# EAGLE design SD2DIPSPI (EAGLE 7.2.0)
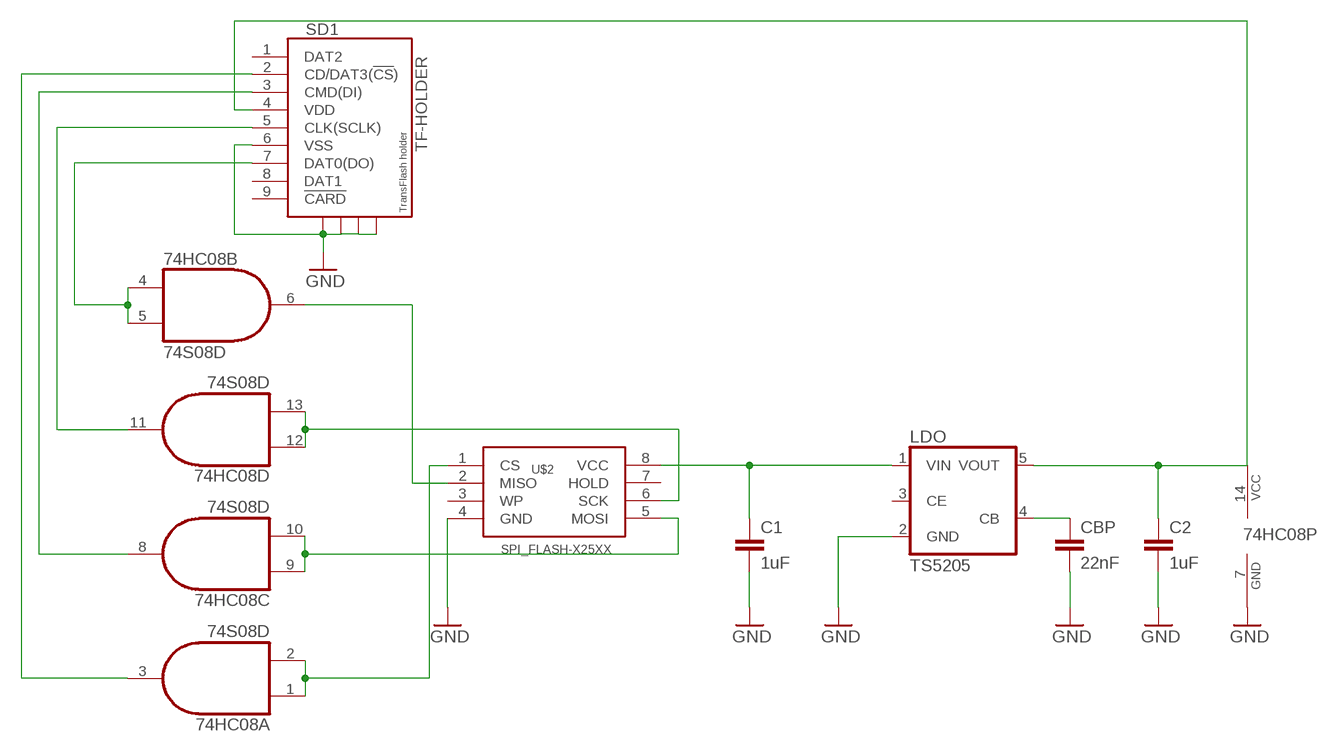
[diagram p0: schematic, sheet 1]

## Parts
74HC08  74S08D  [SO14]
C1  1uF  0.1UF-25V(+80/-20%)(0603)  [0603-CAP]
C2  1uF  0.1UF-25V(+80/-20%)(0603)  [0603-CAP]
CBP  22nF  0.1UF-16V(+-10%)(0402)  [0402-CAP]
LDO  TS5205  [SOT25]
SD1  TF-HOLDER  [TF-PULL]
U$2  SPI_FLASH-X25XX  [DIL08]

## Nets
3V3: 74HC08.14(P:VCC) C2.1 LDO.5(VOUT) SD1.4(VDD)
+5V: C1.1 LDO.1(VIN) U$2.8(VCC)
GND: 74HC08.7(P:GND) C1.2 C2.2 CBP.2 LDO.2(GND) SD1.6(VSS) SD1.S1 SD1.S2 SD1.S3 SD1.S4 U$2.4(GND)
N$2: CBP.1 LDO.4(CB)
N$12: 74HC08.9(C:I0) 74HC08.10(C:I1) U$2.5(MOSI)
N$21: 74HC08.12(D:I0) 74HC08.13(D:I1) U$2.6(SCK)
N$24: 74HC08.1(A:I0) 74HC08.2(A:I1) U$2.1(CS)
N$32: 74HC08.11(D:O) SD1.5(CLK(SCLK))
N$33: 74HC08.8(C:O) SD1.3(CMD(DI))
N$34: 74HC08.3(A:O) SD1.2(CD/DAT3(!CS!))
N$35: 74HC08.6(B:O) U$2.2(MISO)
N$38: 74HC08.4(B:I0) 74HC08.5(B:I1) SD1.7(DAT0(DO))
Unconnected: LDO.3(CE) SD1.1(DAT2) SD1.8(DAT1) SD1.9(!CARD) U$2.3(WP) U$2.7(HOLD)

## Library data of the parts
74HC08 = 74xx-us:74*08: Quad 2-input AND gate
C1 C2 = SparkFun-Capacitors:0.1UF-25V(+80/-20%)(0603): CAP-00810 Ceramic Standard decoupling cap; PROD_ID: CAP-00810; VALUE: 0.1uF
CBP = SparkFun-Capacitors:0.1UF-16V(+-10%)(0402); PROD_ID: CAP-12416; VALUE: 0.1uF
LDO = v-reg:TS5205: 150mA Low Noise LDO Voltage Regulator with Enable TSC [Taiwan Semiconductor Company, Ltd] Source: http://www.taiwansemi.com .. 5205_0409c.pdf
SD1 = sd-mmc:TF-HOLDER: TF / Micro SD socket is PUSH-PUSH type, the card can be pushed into and auto locked and pushed out by simply press the card. Surface Mounting type.
U$2 = SparkFun-DigitalIC:SPI_FLASH-X25XX: 8pin SPI Flash series x25xx. Works with devices like W25X32 and BR25L32

## Net classes
0 default: width 0.254 mm

## Board
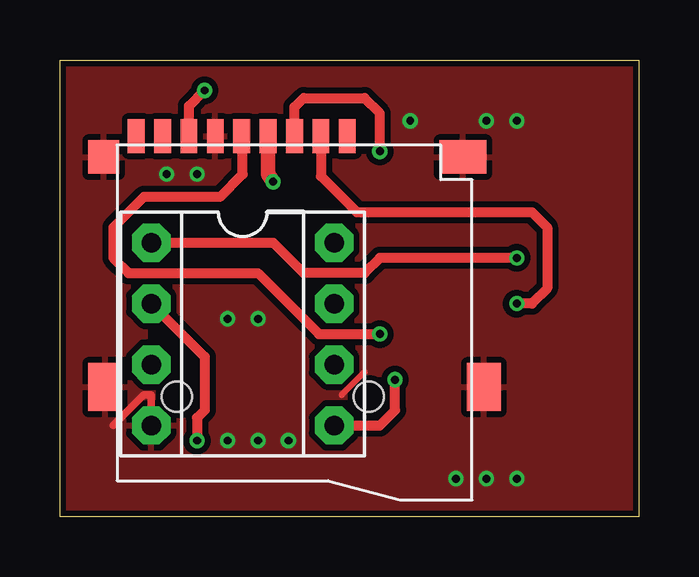
[diagram p1: board, top side]
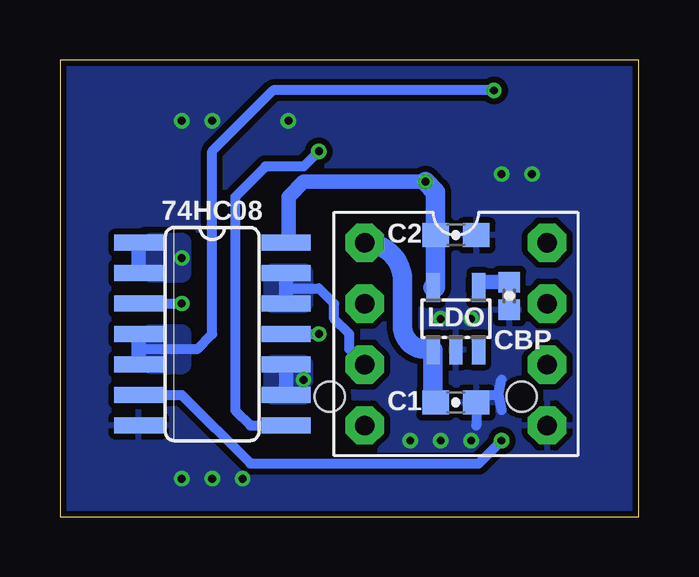
[diagram p2: board, bottom side, seen from below]

Size 24.13 x 19.05 mm. Coordinates in mm from the lower left corner, seen from the top.
Outline: 0,19.05 24.13,19.05 24.13,0 0,0 0,19.05
Copper layers (1*16): Top 0.035mm / dielectric 1.5mm / Bottom 0.035mm
Design rules "SeeedStudio_2layer_DRU_no_angle_20140221": minimum track width 6mil, minimum drill 12mil, track to track 6mil, track to pad 6mil, pad to pad 6mil, via to via 6mil, smd to smd 0mil, copper to edge 10mil, drill to drill 10mil, minimum pad ring 10mil, minimum via ring 6mil, stop-mask expansion 2mil, vias tented up to drill 100mil, thermal gap 10mil

### Footprints (pad centres in the part's own frame; a part is rotated, then mirrored left to right if it is on the bottom)
SO14 = smd 0.66 x 2.032: 1 -3.81,-3.073; 2 -2.54,-3.073; 3 -1.27,-3.073; 4 0,-3.073; 5 1.27,-3.073; 6 2.54,-3.073; 7 3.81,-3.073; 8 3.81,3.073; 9 2.54,3.073; 10 1.27,3.073; 11 0,3.073; 12 -1.27,3.073; 13 -2.54,3.073; 14 -3.81,3.073
0603-CAP = smd 1.1 x 1: 1 -0.85,0; 2 0.85,0
0402-CAP = smd 0.85 x 0.9: 1 -0.58,0; 2 0.58,0
SOT25 = smd 0.55 x 1.2: 1 -0.95,-1.3; 2 0,-1.3; 3 0.95,-1.3; 4 0.95,1.3; 5 -0.95,1.3
TF-PULL = smd 0.7 x 1.4: 1 -2.2,-7.62; 2 -1.1,-7.62; 3 0,-7.62; 4 1.1,-7.62; 5 2.2,-7.62; 6 3.3,-7.62; 7 4.4,-7.62; 8 5.5,-7.62; 9 6.6,-7.62 | smd 1.4 x 2: S1 -7.9,2.85; S2 7.9,2.85 | smd 1.28 x 1.4: S3 7.96,-6.75 | smd 1.95 x 1.4: S4 -7.025,-6.75 | hole 1.25: -3.1,3.25; 4.9,3.25
DIL08 = drill 0.813 pad 1.6 octagon: 1 -3.81,-3.81; 2 -1.27,-3.81; 3 1.27,-3.81; 4 3.81,-3.81; 5 3.81,3.81; 6 1.27,3.81; 7 -1.27,3.81; 8 -3.81,3.81

### Placement (x,y rotation side)
74HC08  17.78,7.62 270 bottom
C1  7.62,4.76 0 bottom
C2  7.62,11.75 0 bottom
CBP  5.4,9.21 270 bottom
LDO  7.62,8.26 0 bottom
SD1  9.78,8.26 180 top
U$2  7.62,7.62 270 top

### Tracks (layer width: path | path; a pad name or v marks a point on that pad's centre or on a via)
3V3  (via drill 0.33 pad 0.64)
  Top 0.61: SD1.4 8.68,14.29 v8.89,13.97
  Bottom 0.406: 74HC08.14 14.61,11.53
  Bottom 0.61: 14.61,11.53 14.61,13.34 13.97,13.97 v8.89,13.97
  Bottom 0.813: v8.89,13.97 8.47,13.55 C2.1 8.47,9.55 LDO.5
+5V
  Bottom 0.813: U$2.8 arc90 9.84,9.84 9.84,7.94 arc-90 8.89,6.99 8.6,6.99 LDO.1 8.57,5.18 C1.1
GND  (via drill 0.33 pad 0.64)
  Top 0.254: 11.75,5.08 12.7,6.03
  Top 0.305: 2.22,3.81 3.49,5.08 3.81,5.08 U$2.4
  Bottom 0.406: C1.2 6.77,3.81 | 6.35,5.08 5.84,5.08 | 5.84,5.08 5.71,5.71 | 5.84,5.08 5.71,4.45
  other vias: 16.51,1.59 4.45,14.29 9.53,3.17 19.05,1.59 17.78,1.59 19.05,16.51 17.78,16.51 14.61,16.51 6.99,3.17 8.26,3.17 5.71,14.29 6.99,8.26 8.26,8.26
  pour Bottom (isolate 0.254, rank 4): 0,19.05 24.13,19.05 24.13,0 0,0
  pour Top (isolate 0.254): 0,19.05 24.13,19.05 24.13,0 0,0
N$2
  Bottom 0.61: CBP.1 6.67,9.79 LDO.4
N$3
  cutout Bottom: 8.89,8.89 8.89,10.16 9.53,10.16 9.53,8.89
  cutout Top: 3.81,6.99 3.81,8.26 5.08,6.99
N$12  (via drill 0.33 pad 0.64)
  Top 0.406: U$2.5 13.34,3.81 13.97,4.45 v13.97,5.71
  Bottom 0.406: 14.71,5.71 74HC08.10
  Bottom 0.61: 74HC08.9 74HC08.10
  pour Bottom (isolate 0.254, no thermals): 15.24,6.35 13.97,6.35 13.97,5.08 15.24,5.08
N$21
  Bottom 0.406: 74HC08.12 14.71,9.53 13.34,9.53 12.7,8.89 12.7,8.26 12.06,7.62 12.06,6.99 U$2.6
  Bottom 0.61: 74HC08.13 74HC08.12
  pour Bottom (isolate 0.254, no thermals): 15.24,10.16 13.97,10.16 13.97,8.89 15.24,8.89
N$24  (via drill 0.33 pad 0.64)
  Top 0.406: U$2.1 8.89,11.43 10.16,10.16 12.7,10.16 13.34,10.79 v19.05,10.79
  Bottom 0.61: 74HC08.1 74HC08.2
  pour Bottom (isolate 0.254, no thermals): 19.05,11.43 20.32,11.43 20.32,10.16 19.05,10.16
N$32  (via drill 0.33 pad 0.64)
  Top 0.406: v13.34,7.62 10.79,7.62 8.26,10.16 2.86,10.16 2.22,10.79 2.22,12.06 3.49,13.34 6.67,13.34 7.62,14.29 7.62,15.88 SD1.5
  Bottom 0.406: 74HC08.11 v13.34,7.62
N$33  (via drill 0.33 pad 0.64)
  Top 0.406: SD1.3 9.78,17.08 10.16,17.46 12.7,17.46 13.34,16.83 v13.34,15.24
  Bottom 0.406: v13.34,15.24 13.97,14.61 15.56,14.61 16.83,13.34 16.83,4.45 16.19,3.81 74HC08.8
N$34  (via drill 0.33 pad 0.64)
  Top 0.406: v19.05,8.89 19.68,8.89 20.32,9.53 20.32,12.06 19.68,12.7 12.38,12.7 10.88,14.2 SD1.2
  Bottom 0.406: 74HC08.3 v19.05,8.89
N$35  (via drill 0.33 pad 0.64)
  Top 0.406: U$2.2 6.03,6.67 6.03,4.45 5.71,4.13 v5.71,3.17
  Bottom 0.406: 74HC08.6 19.05,5.08 16.19,2.22 6.67,2.22 v5.71,3.17
N$38  (via drill 0.33 pad 0.64)
  Top 0.406: SD1.7 5.38,17.13 v6.03,17.78
  Bottom 0.406: 20.85,6.99 18.41,6.99 17.78,7.62 17.78,15.24 15.24,17.78 v6.03,17.78
  Bottom 0.61: 74HC08.4 20.85,6.99 74HC08.5
  pour Bottom (isolate 0.254, no thermals): 19.05,7.62 20.32,7.62 20.32,6.35 19.05,6.35

### Text on the board
tDocu: DO | V- | CK | V+ | DI | CS | μSD to SPI EEPROM / Designed by DC
bDocu: CS | SCK | MISO | MOSI